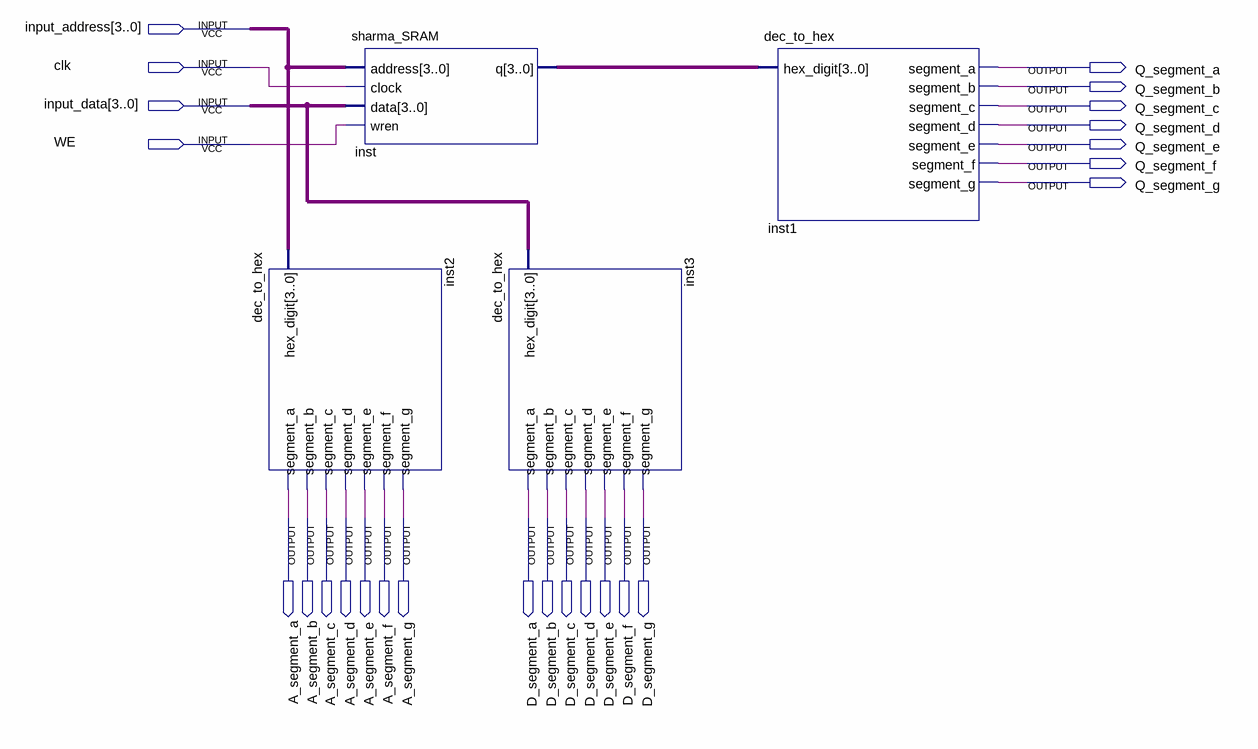
[diagram p0: schematic sheet]
// Quartus schematic sharma_16x4_LPM.bdf as structural Verilog: 4 symbols, 25 pins
module sharma_16x4_LPM (
  input  [3:0] input_address,
  input  clk,
  input  [3:0] input_data,
  input  WE,
  output Q_segment_a,
  output Q_segment_b,
  output Q_segment_c,
  output Q_segment_d,
  output Q_segment_e,
  output Q_segment_f,
  output Q_segment_g,
  output A_segment_a,
  output A_segment_b,
  output A_segment_c,
  output A_segment_d,
  output A_segment_e,
  output A_segment_f,
  output A_segment_g,
  output D_segment_a,
  output D_segment_b,
  output D_segment_c,
  output D_segment_d,
  output D_segment_e,
  output D_segment_f,
  output D_segment_g
);

  wire [3:0] inst_q;

  dec_to_hex inst2 (
    .hex_digit(input_address), .segment_a(A_segment_a), .segment_b(A_segment_b), .segment_c(A_segment_c),
    .segment_d(A_segment_d), .segment_e(A_segment_e), .segment_f(A_segment_f), .segment_g(A_segment_g));
  sharma_SRAM inst (.address(input_address), .clock(clk), .data(input_data), .wren(WE), .q(inst_q));
  dec_to_hex inst3 (
    .hex_digit(input_data), .segment_a(D_segment_a), .segment_b(D_segment_b), .segment_c(D_segment_c),
    .segment_d(D_segment_d), .segment_e(D_segment_e), .segment_f(D_segment_f), .segment_g(D_segment_g));
  dec_to_hex inst1 (
    .hex_digit(inst_q), .segment_a(Q_segment_a), .segment_b(Q_segment_b), .segment_c(Q_segment_c),
    .segment_d(Q_segment_d), .segment_e(Q_segment_e), .segment_f(Q_segment_f), .segment_g(Q_segment_g));
endmodule
